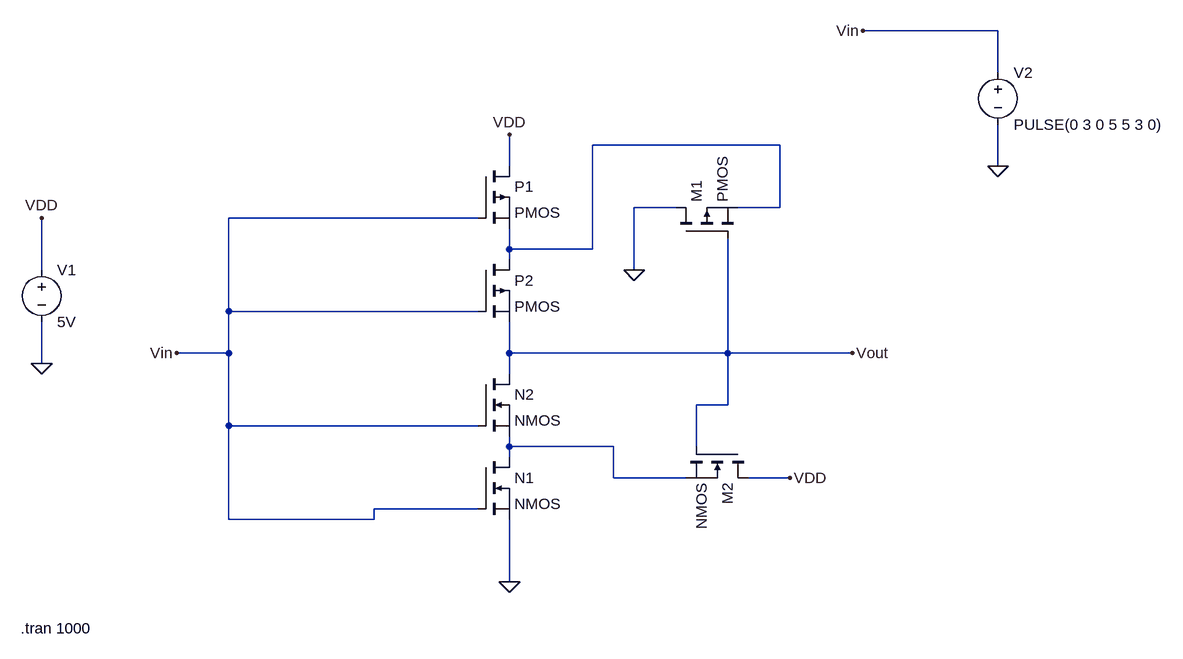
[diagram p0: schematic Draft1.asc]
Draft1.asc, the LTspice schematic file:
Version 4
SHEET 1 1288 680
WIRE 944 -368 736 -368
WIRE 944 -304 944 -368
WIRE 608 -192 320 -192
WIRE 192 -160 192 -208
WIRE 944 -160 944 -224
WIRE 448 -96 384 -96
WIRE 608 -96 608 -192
WIRE 608 -96 544 -96
WIRE 144 -80 -240 -80
WIRE 192 -32 192 -64
WIRE 320 -32 320 -192
WIRE 320 -32 192 -32
WIRE 192 -16 192 -32
WIRE -528 0 -528 -80
WIRE 384 0 384 -96
WIRE -240 64 -240 -80
WIRE 144 64 -240 64
WIRE -240 128 -240 64
WIRE -240 128 -320 128
WIRE 192 128 192 80
WIRE 528 128 528 -48
WIRE 528 128 192 128
WIRE 720 128 528 128
WIRE -528 144 -528 80
WIRE 192 160 192 128
WIRE 528 208 528 128
WIRE 528 208 480 208
WIRE -240 240 -240 128
WIRE 144 240 -240 240
WIRE 192 272 192 256
WIRE 352 272 192 272
WIRE 480 272 480 208
WIRE 192 288 192 272
WIRE 352 320 352 272
WIRE 464 320 352 320
WIRE 624 320 560 320
WIRE 144 368 -16 368
WIRE -240 384 -240 240
WIRE -16 384 -16 368
WIRE -16 384 -240 384
WIRE 192 480 192 384
FLAG 192 480 0
FLAG 192 -208 VDD
FLAG -528 144 0
FLAG -528 -80 VDD
FLAG -320 128 Vin
FLAG 720 128 Vout
FLAG 944 -160 0
FLAG 736 -368 Vin
FLAG 384 0 0
FLAG 624 320 VDD
DATAFLAG 192 -176 ""
DATAFLAG 576 320 ""
SYMBOL nmos 144 160 R0
SYMATTR InstName N2
SYMBOL nmos 144 288 R0
SYMATTR InstName N1
SYMBOL pmos 144 -16 R0
SYMATTR InstName P2
SYMBOL pmos 144 -160 R0
SYMATTR InstName P1
SYMBOL voltage -528 -16 R0
WINDOW 123 0 0 Left 0
WINDOW 39 0 0 Left 0
SYMATTR InstName V1
SYMATTR Value 5V
SYMBOL voltage 944 -320 R0
WINDOW 123 0 0 Left 0
WINDOW 39 0 0 Left 0
SYMATTR InstName V2
SYMATTR Value PULSE(0 3 0 5 5 3 0)
SYMBOL pmos 448 -48 R270
SYMATTR InstName M1
SYMBOL nmos 560 272 R90
SYMATTR InstName M2
TEXT -560 552 Left 2 !.tran 1000

The netlist it stands for:
* Draft1.asc
M§N2 Vout Vin N002 N002 NMOS
M§N1 N002 Vin 0 0 NMOS
M§P2 N001 Vin Vout Vout PMOS
M§P1 VDD Vin N001 N001 PMOS
V1 VDD 0 5V
V2 Vin 0 PULSE(0 3 0 5 5 3 0)
M1 0 Vout N001 N001 PMOS
M2 VDD Vout N002 N002 NMOS
.model NMOS NMOS
.model PMOS PMOS
.lib standard.mos
.tran 1000
.backanno
.end